# Altium schematic sheet Quad FC power V10.0.SchDoc
size A4; SheetNumber: 2; SheetTotal: 2
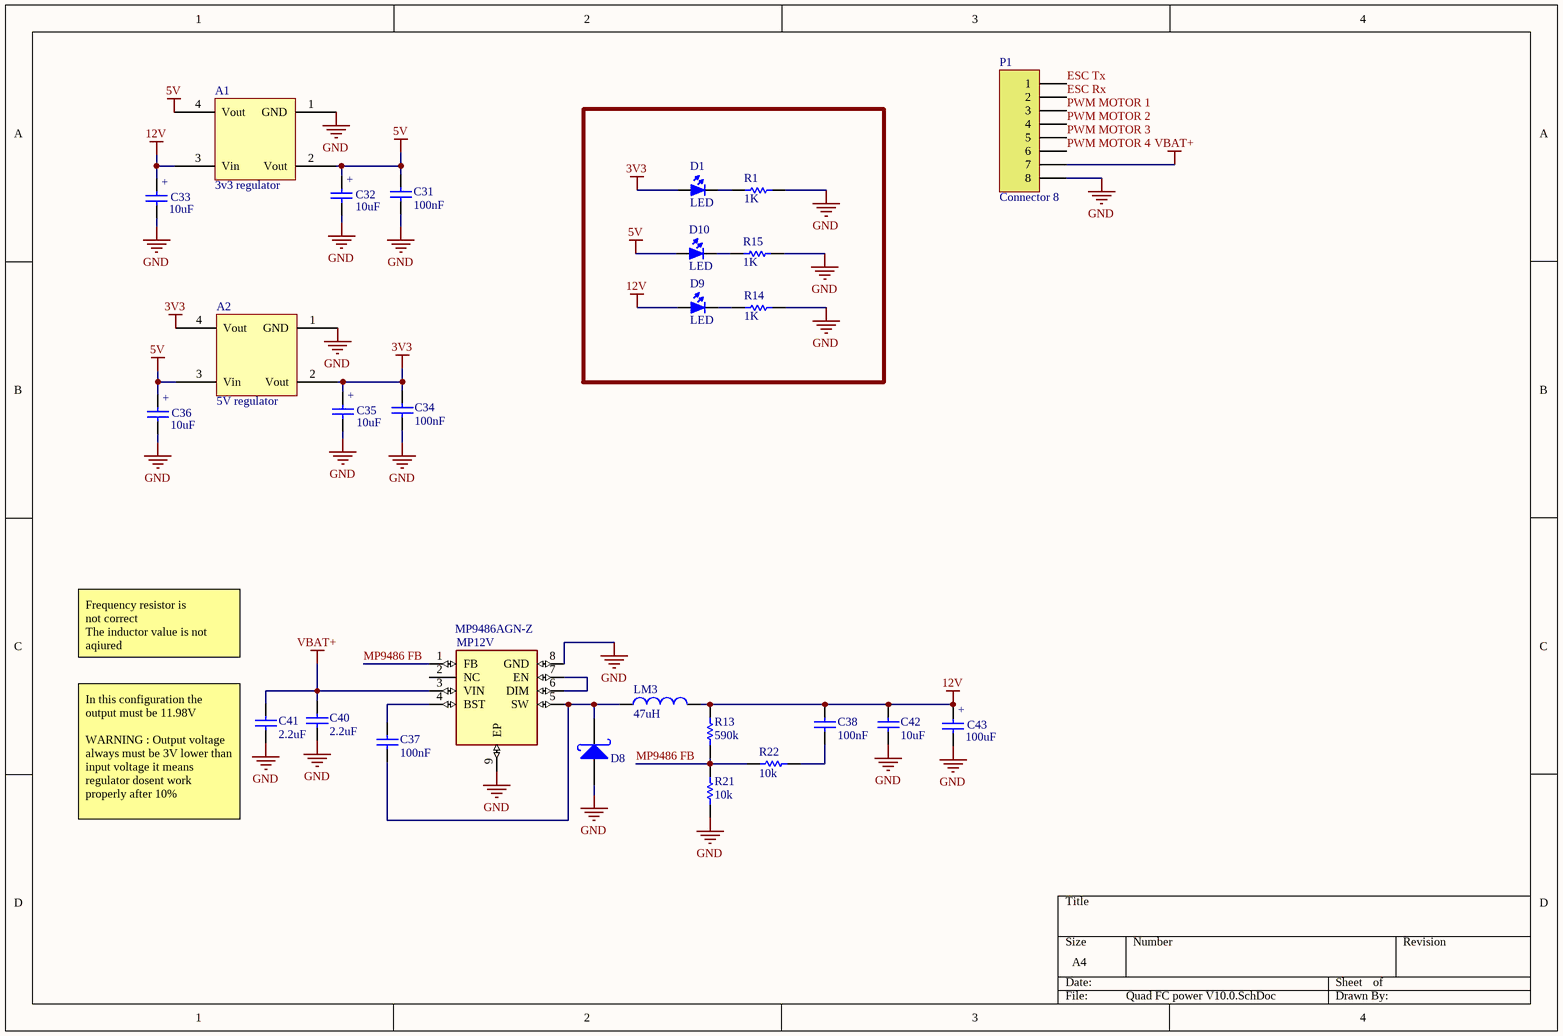
[diagram p0: Quad FC power V10.0.SchDoc]

## Parts
A1  3v3 regulator  [SOT230P700X180-4N]
A2  5V regulator  [SOT230P700X180-4N]
C31  100nF  [CAP0603]
C32  10uF  [MY_CAP_SMD-B]
C33  10uF  [MY_CAP_SMD-B]
C34  100nF  [CAP0603]
C35  10uF  [MY_CAP_SMD-B]
C36  10uF  [MY_CAP_SMD-B]
C37  100nF  [CAP0603]
C38  100nF  [CAP0603]
C40  2.2uF  [CAPC3413X12N]
C41  2.2uF  [CAPC3413X12N]
C42  10uF  [CAPC3413X12N]
C43  100uF  [MY_CAP_SMD-B]
D1  LED  [0603 - LED]
D8  SS34  [DIOM4226X244N]  (value not drawn)
D9  LED  [0603 - LED]
D10  LED  [0603 - LED]
LM3  47uH  [IND_RLS-105]
MP12V  MP9486AGN-Z  [SOIC127P600X170-9N]
P1  Connector 8  [JST B8B-PH-K]
R1  1K  [RES0603]
R13  590k  [RES0603]
R14  1K  [RES0603]
R15  1K  [RES0603]
R21  10k  [RES0603]
R22  10k  [RES0603]

## Nets
3V3: A2.2(Vout) A2.4(Vout) C34.2 C35.+ D1.1(A)
5V: A1.2(Vout) A1.4(Vout) A2.3(Vin) C31.2 C32.+ C36.+ D10.1(A)
12V: A1.3(Vin) C33.+ C38.2 C42.2 C43.+ D9.1(A) LM3.2 R13.2
GND: A1.1(GND) A2.1(GND) C31.1 C32.- C33.- C34.1 C35.- C36.- C40.2 C41.2 C42.1 C43.- D8.1(A) MP12V.8(GND) MP12V.9(EP) P1.8 R1.2 R14.2 R15.2 R21.1
VBAT+: C40.1 C41.1 MP12V.3(VIN) P1.7
ESC Rx: P1.2
ESC Tx: P1.1
MP9486 FB: MP12V.1(FB) R13.1 R21.2 R22.2
PWM MOTOR 1: P1.3
PWM MOTOR 2: P1.4
PWM MOTOR 3: P1.5
PWM MOTOR 4: P1.6
NetC37_1: C37.1 D8.2(K) LM3.1 MP12V.5(SW)
NetC37_2: C37.2 MP12V.4(BST)
NetC38_1: C38.1 R22.1
NetD1_2: D1.2(K) R1.1
NetD9_2: D9.2(K) R14.1
NetD10_2: D10.2(K) R15.1
NetMP12V_6: MP12V.6(DIM) MP12V.7(EN)

Not connected (* = marked no-connect by the designer): MP12V 2(NC)

## Notes on the sheet
- Frequency resistor is
  not correct
  The inductor value is not aqiured
- (near C41) In this configuration the output must be 11.98V
  WARNING : Output voltage always must be 3V lower than input voltage it means regulator dosent work properly after 10%

## Library data of the parts
A1 A2 = ams1117
C31 C34 C37 C38 = CAP SMD PACKAGE: F407VET6 Power CAP; Designer: Abbas Basereh; Desc.: CAP SMD TOTAL PACKAGES; Data: 2017-3-10
C32 C33 C35 C36 C43 = CAP_TANTAL_B: 3.5X2.8MM; Value: 3300u
C40-C42 = CAP SMD 0805: CAP 0805; Designer: Abbas Basereh; Desc.: CAP SMD 0805; Data: 16-12-2016
D8 = 1n5822 SMD: Manufacturer: ON Semiconductor/Fairchild; Designer: Abbas Basereh; Link: https://www.aliexpress.com/item/Free-shipping-100pcs-1n5822-sma-smd-do-214ac-Schottky-diode-ss34/32337482329.html?spm=2114.01010208.3.1.zLZDsP&ws_ab_test=searchweb0_0,searchweb201602_4_10065_10068_10084_10083_10080_10082_10081_10060_10061_10062_10056_10055_10054_10059_10099_10078_10079_427_10073_10103_10102_10096_10052_10050_10051,searchweb201603_4&btsid=6e50dc92-ac69-45bc-a19e-209af19ce602; Link: http://www.tme.eu/en/details/ss34/smd-schottky-diodes/vishay/ss34-e357t/; Link: http://www.digikey.com/product-detail/en/on-semiconductor-fairchild/SS34/SS34FSCT-ND/2094459; Part. No: SS34; Data: 16-12-2016
LM3 = L SMA 0.25W: Inductor; Code_IEC: 1005; Published: 8-Jun-2000; LatestRevisionDate: 29-May-2009; LatestRevisionNote: IPC-7351 Footprint Added.; PackageReference: 0402-A; Publisher: Altium Limited; PackageDescription: Chip Inductor; Code_JEITA: 0402
MP12V = MP9486AGN-Z: Buck Switching Regulator IC Positive Fixed 5V 1 Output 1A 8-SOIC (0.154, 3.90mm Width) Exposed Pad; MF: Monolithic Power; SnapEDA_Link: https://www.snapeda.com/parts/MP9486AGN-Z/Monolithic+Power+Systems+Inc./view-part/?ref=snap; Package: SOIC-8 Monolithic Power; Value: *; MP: MP9486AGN-Z; Check_prices: https://www.snapeda.com/parts/MP9486AGN-Z/Monolithic+Power+Systems+Inc./view-part/?ref=eda
P1 = Connector1x8: Connector, 8-Pin2.5mm; LatestRevisionDate: 17-Jul-2002; LatestRevisionNote: Re-released for DXP Platform.; Publisher: Altium Limited
R1 R14 R15 = RES SMD PACKAGE: TOTAL SMD RESISTOR PACK; Designer: Abbas Basereh; Desc.: RES SMD PAKAGES; Data: 2017-3-10; VALUE: 1K
R13 R21 R22 = RES SMD PACKAGE: To Limit current; Designer: Abbas Basereh; Desc.: RES SMD PAKAGES; VALUE: 1K; Data: 2017-3-10
D1 D9 D10 = LED: Published: 8-Jun-2000; LatestRevisionDate: 08-Jul-2005; LatestRevisionNote: Mech Layer 1 removed.; PackageReference: LED-0; Publisher: Altium Limited